# Altium schematic sheet OZ440-SE130-CAR001-SCH2.SchDoc: Carte IMU GPS
size A3; Date: 08/04/14; CheckedBy: GS; Author: BM; DocumentNumber: OZ440-SE110-CAR001-SCH01; Revision: A; SheetNumber: 1; SheetTotal: 1
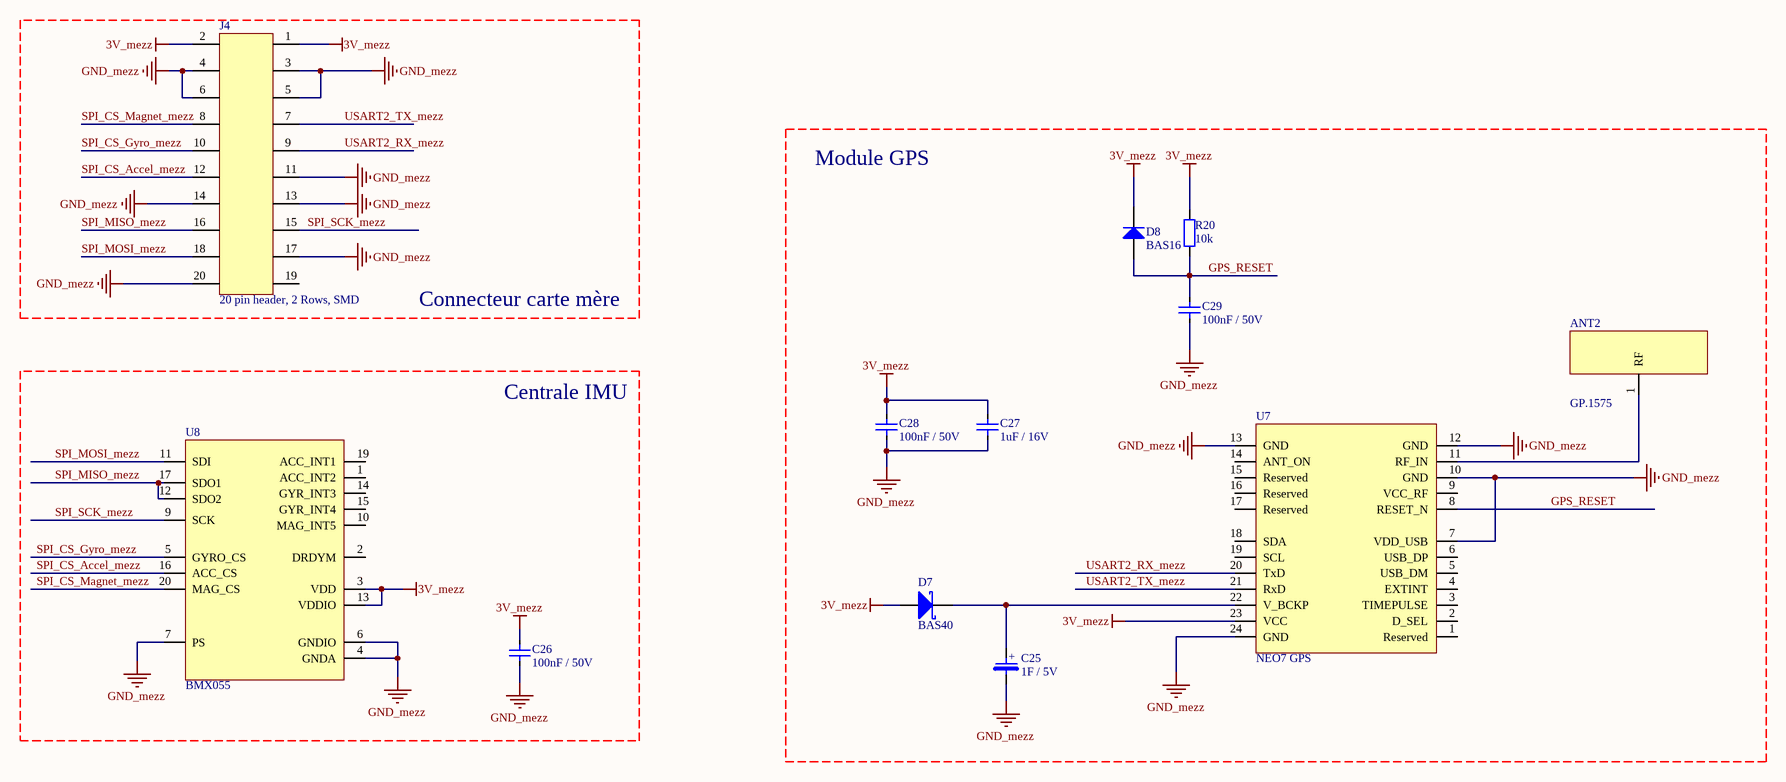
[diagram p0: OZ440-SE130-CAR001-SCH2.SchDoc]

## Parts
ANT2  Displayed reference: GP.1575  [ANT_SMD-SPE-GP_1575]  (hidden comment: ANT-STD-GPS)
C25  Displayed reference: 1F / 5V  [RADIAL-STD-P20-H5-D20]  (hidden comment: CAP-POL-SMD)
C26  Displayed reference: 100nF / 50V  [C0805-STD]  (hidden comment: CAP-SMD)
C27  Displayed reference: 1uF / 16V  [C0805-STD]  (hidden comment: CAP-SMD)
C28  Displayed reference: 100nF / 50V  [C0805-STD]  (hidden comment: CAP-SMD)
C29  Displayed reference: 100nF / 50V  [C0805-STD]  (hidden comment: CAP-SMD)
D7  Displayed reference: BAS40  [SOT23-STD]  (hidden comment: BAS40-SOT23)
D8  Displayed reference: BAS16  [SOT23-STD]  (hidden comment: BAS16-SOT23)
J4  Displayed reference: 20 pin header, 2 Rows, SMD  [CONN-SPE_TSM110-02-T]  (hidden comment: CONN-STD-20P_2ROW)
R20  Displayed reference: 10k  [R0805-STD]  (hidden comment: RES-SMD)
U7  Displayed reference: NEO7 GPS  [SMD24-SPE-NEO7]  (hidden comment: NEO_7-SMD24)
U8  Displayed reference: BMX055  [LGA20-SPE-BMX055]  (hidden comment: BMX055-LGA20)

## Nets
3V_mezz: C26.2 C27.2 C28.2 D7.1(A) D8.3(K) J4.1 J4.2 R20.2 U7.23(VCC) U8.3(VDD) U8.13(VDDIO)
GND_mezz: C25.2 C26.1 C27.1 C28.1 C29.1 J4.3 J4.4 J4.5 J4.6 J4.11 J4.13 J4.14 J4.17 J4.20 U7.7(VDD_USB) U7.10(GND) U7.12(GND) U7.13(GND) U7.24(GND) U8.4(GNDA) U8.6(GNDIO) U8.7(PS)
GPS_RESET: C29.2 D8.1(A) R20.1 U7.8(RESET_N)
SPI_CS_Accel_mezz: J4.12 U8.16(ACC_CS)
SPI_CS_Gyro_mezz: J4.10 U8.5(GYRO_CS)
SPI_CS_Magnet_mezz: J4.8 U8.20(MAG_CS)
SPI_MISO_mezz: J4.16 U8.12(SDO2) U8.17(SDO1)
SPI_MOSI_mezz: J4.18 U8.11(SDI)
SPI_SCK_mezz: J4.15 U8.9(SCK)
USART2_RX_mezz: J4.9 U7.20(TxD)
USART2_TX_mezz: J4.7 U7.21(RxD)
NetANT2_1: ANT2.1(RF) U7.11(RF_IN)
NetC25_1: C25.1 D7.3(K) U7.22(V_BCKP)

Not connected (* = marked no-connect by the designer): J4 19; U7 1(Reserved) 2(D_SEL) 3(TIMEPULSE) 4(EXTINT) 5(USB_DM) 6(USB_DP) 9(VCC_RF) 14(ANT_ON) 15(Reserved) 16(Reserved) 17(Reserved) 18(SDA) 19(SCL); U8 1(ACC_INT2) 2(DRDYM) 10(MAG_INT5) 14(GYR_INT3) 15(GYR_INT4) 19(ACC_INT1)

## Notes on the sheet
- Module GPS
- Connecteur carte mère
- Centrale IMU
- Titre document:
- NAIO TECHNOLOGIES
- 3 Av didier Daurat
- 31400 TOULOUSE
- Auteur:
- Numéro document:
- Verificateur:
- Format:
- A3
- Date:
- Revision:
- Page:
- /
- (in symbol EDLSG105H5R5C) +

## Library data of the parts
ANT2 = GP.1575.35.3.A.02: 35mm GPS patch antenna; Manufacturer: Taoglass; Frequency band: 1575Mhz; Gain: 2Dbic; Validated: False; reference: GP.1575.35.3.A.02; Component type: antenna; Pin Count: 1; Rev: A; helpURL: http://www.taoglas.com/images/product_images/original_images/GP.1575.35.3.A.pdf; Supplier 1: Mouser; Supplier Part Number 1: 960-GP1575353A02; Supplier 2: Digi-Key; Supplier Part Number 2: 931-1120-ND
C25 = EDLSG105H5R5C: 1F 5V capacitor; Manufacturer: Cornell Dubillier; Validated: False; Reference: EDLSG105H5R5C; Value: 1F; Max Voltage: 5V; Footprint description: 20mm pitch, 20mm diam / 5mm height, radial mount; Pin Count: 2; helpURL: http://www.mouser.com/ds/2/88/EDL-19670.pdf; Supplier 1: Mouser; Supplier Part Number 1: 598-EDLSG105H5R5C; Supplier 2: Farnell; Supplier Part Number 2: 1364209
C26 C28 C29 = VJ0805Y104KXAxx: 0805 100nF / 50V  X7R ceramic capacitor; Manufacturer: vishay; Max Voltage: 50; Tolerance: +/- 10%; Validated: N; Reference: VJ0805Y104KXAxx; Value: 100nF; Material: X7R; Footprint description: standard Capacitor 0805; Pin Count: 2; helpURL: http://www.vishay.com/docs/45200/highrels.pdf; Supplier 1: Farnell; Supplier Part Number 1: 1612208; Supplier 2: Digi-Key; Supplier Part Number 2: 720-1266-6-ND
C27 = C0805C105K4RACxx: 0805 1uF / 16V X7R ceramic capacitor; Manufacturer: Kemet; Max Voltage: 16; Tolerance: +/- 10%; Validated: N; Reference: C0805C105K4RACxx; Value: 1uF; Material: X7R; Footprint description: standard Capacitor 0805; Pin Count: 2; helpURL: http://www.farnell.com/datasheets/40863.pdf; Supplier 1: Farnell; Supplier Part Number 1: 9227792; Supplier 2: Digi-Key; Supplier Part Number 2: 399-6930-1-ND
D7 = BAS40: 40V / 120mA signal schottky diode; Manufacturer: NXP; Max Voltage: 40; Max Current: 0.12A; Validated: False; Reference: BAS40; component type: DIODE; Footprint description: Sot23 SMD package; Pin Count: 3; Rev: 2010; helpURL: http://www.nxp.com/documents/data_sheet/BAS40_1PSXXSB4X_SER.pdf; Supplier 1: Farnell; Supplier Part Number 1: 8734291; Supplier 2: Newark; Supplier Part Number 2: 79R2090
D8 = BAS16: 100V / 120mA signal  diode; Manufacturer: NXP; Max Voltage: 100; Max Current: 0.2A; Validated: False; Reference: BAS16; component type: DIODE; Footprint description: Sot23 SMD package; Pin Count: 3; Rev: 2010; helpURL: http://www.nxp.com/documents/data_sheet/BAS16_SER.pdf; Supplier 1: Farnell; Supplier Part Number 1: 1081180; Supplier 2: Digi-Key; Supplier Part Number 2: 568-1596-1-ND
J4 = TSM-110-02-T-DV: 20 pin header, 2.54mm, SMD; Manufacturer: SAMTEC; Validated: False; Reference: TSM-110-02-T-DV; Footprint description: 20 pin header, SMD; Pin Count: 20; helpURL: http://www.samtec.com/ftppub/pdf/tsm.pdf; Supplier 1: Farnell; Supplier Part Number 1: 2056038
R20 = CRCW080510K0FKxx: 10k Ohm 0805 SMD resistor; Manufacturer: Vishay; Value: 10 000; Tolerance: 1 %; Rated Power: 0,125 W; Validated: No; Reference: CRCW080510K0FKxx; Footprint description: standard 0805 SMD; Pin Count: 2; helpURL: http://www.vishay.com/docs/20035/dcrcwe3.pdf; Supplier 1: Farnell; Supplier Part Number 1: 1469856; Supplier 2: Mouser; Supplier Part Number 2: 71-CRCW0805-10K-E3
U7 = NEO-7: Neo 7 GPS module; Manufacturer: Ublox; Reference: NEO-7; Max Voltage: 3.6V; Validated: False; Footprint description: SMD 24 pin; Pin Count: 24; Rev: 07; helpURL: http://www.u-blox.com/images/downloads/Product_Docs/MAX7-NEO7_HardwareIntegrationManual_(UBX-13003704).pdf
U8 = BMX055: 9 axis SPI IMU sensor; Manufacturer: Bosch; Max Voltage: 3.6V; Validated: False; Reference: BMX055; Footprint description: LGA 20 pins; Pin Count: 20; Rev: 1; helpURL: http://ae-bst.resource.bosch.com/media/products/dokumente/bmx055/BST-BMX055-DS000-01.pdf; Supplier 1: Mouser; Supplier Part Number 1: 262-BMX055